# Altium schematic sheet Power.SchDoc
size A4
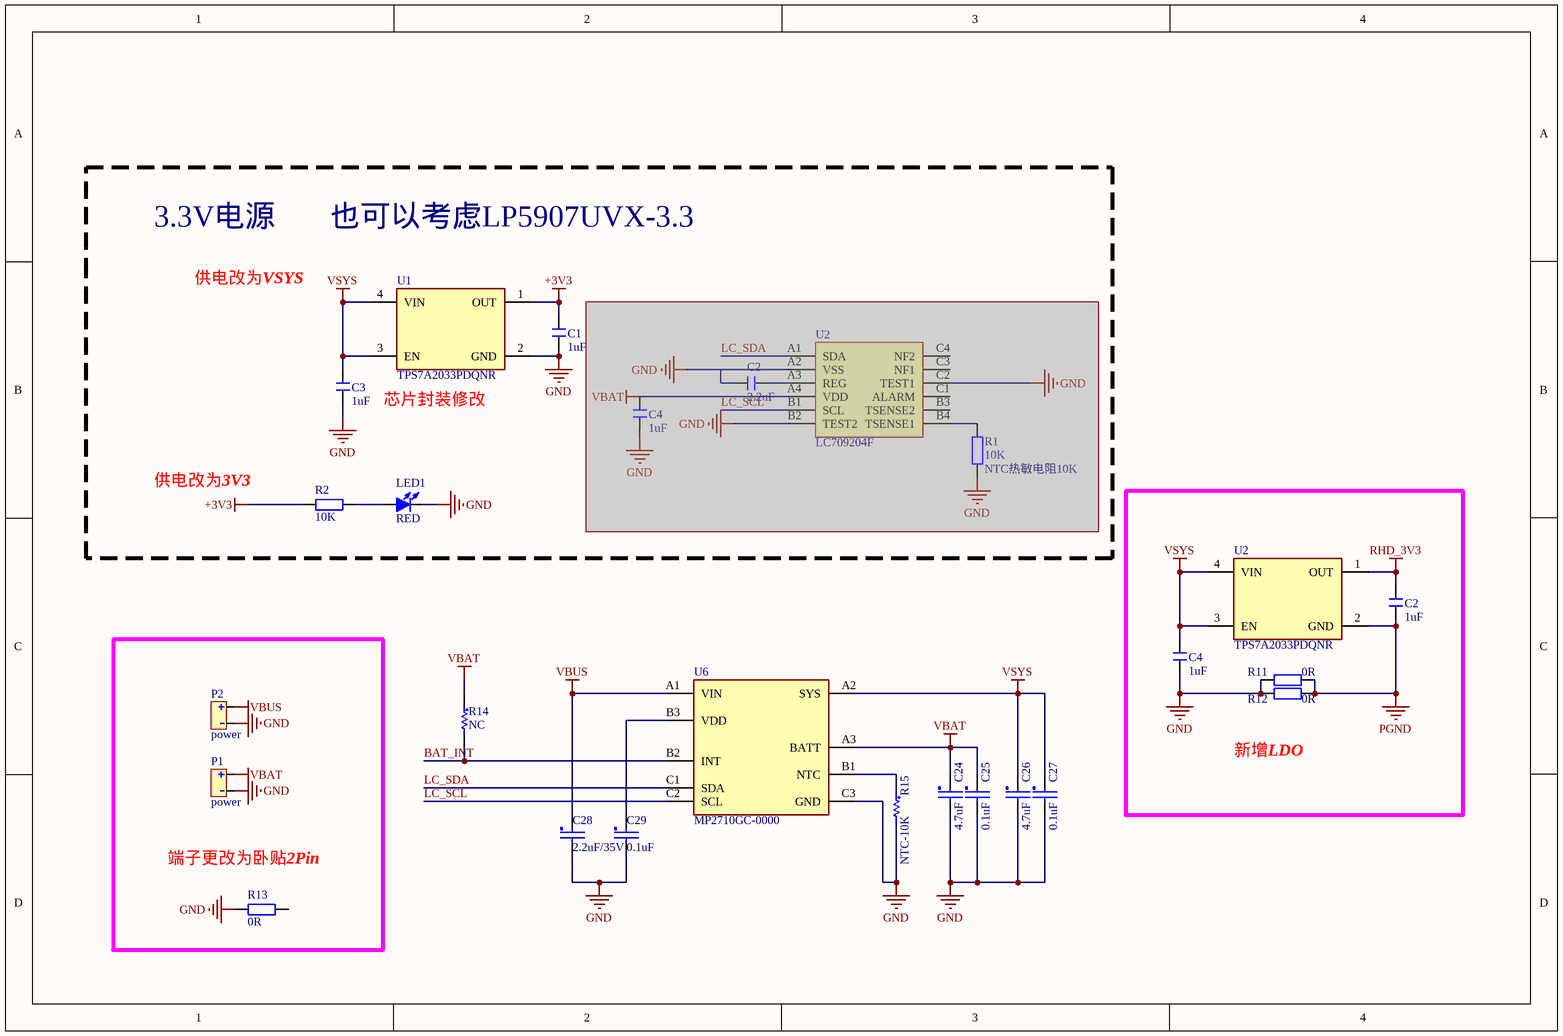
[diagram p0: Power.SchDoc]

## Parts
(Parts that share a designator on the sheet are numbered #1, #2 ... from top to bottom, then left to right.)
C1  1uF  [C 0201_L]
C2#1  2.2uF  [C 0201_L]  (masked out: inside a compile mask, not in the netlist)
C2#2  1uF  [C 0201_L]
C3  1uF  [C 0201_L]
C4#1  1uF  [C 0201_L]  (masked out: inside a compile mask, not in the netlist)
C4#2  1uF  [C 0201_L]
C24  4.7uF  [0201(C)]
C25  0.1uF  [0201(C)]
C26  4.7uF  [0201(C)]
C27  0.1uF  [0201(C)]
C28  2.2uF/35V  [0201(C)]
C29  0.1uF  [0201(C)]
LED1  RED  [LED-SMD_L0.7-W0.4-RD_BLUE - duplicate]
P1  power  [CONN-SMD_SM02B-SURS-TF-LF-SN - duplicate]
P2  power  [HDR-SMD_2P-P1.27-V-M-LS4.2-R1]
R1  10K  BOM名称: NTC热敏电阻10K  [R0201]  (masked out: inside a compile mask, not in the netlist)
R2  10K  [R 0201_L]
R11  0R  [R 0201_L]
R12  0R  [R 0201_L]
R13  0R  [0402(R)]
R14  NC  [0201(R)]  (no BOM)
R15  NTC-10K  [0201(R)]
U1  TPS7A2033PDQNR  [X2SON-0.4]
U2#1  LC709204F  [WLCSP-12_L2.0-W1.5-R3-C4-P0.40-TL]  (masked out: inside a compile mask, not in the netlist)
U2#2  TPS7A2033PDQNR  [X2SON-0.4]
U6  MP2710GC-0000  [WLCSP3*3-P0.5mm]

## Blocks framed on the sheet
新增LDO: C2#2 C4#2 R11 R12 U2#2
端子更改为卧贴2Pin: P1 P2 R13

## Nets
+3V3: C1.2 R2.1 U1.1(OUT)
GND: C1.1 C3.1 C4#2.1 C24.2 C25.2 C26.2 C27.2 C28.2 C29.2 LED1.2(K) P1.1(-) P2.1(-) R11.1 R12.1 R13.1 R15.2 U1.2(GND) U6.C3(GND)
PGND: C2#2.1 R11.2 R12.2 U2#2.2(GND)
RHD_3V3: C2#2.2 U2#2.1(OUT)
VBAT: C24.1 C25.1 P1.2(+) R14.1 U6.A3(BATT)
VBUS: C28.1 P2.2(+) U6.A1(VIN)
VSYS: C3.2 C4#2.2 C26.1 C27.1 U1.3(EN) U1.4(VIN) U2#2.3(EN) U2#2.4(VIN) U6.A2(SYS)
BAT_INT: R14.2 U6.B2(INT)
LC_SCL: U6.C2(SCL)
LC_SDA: U6.C1(SDA)
NetC29_1: C29.1 U6.B3(VDD)
NetLED1_1: LED1.1(A) R2.2
NetR15_1: R15.1 U6.B1(NTC)

Not connected (* = marked no-connect by the designer): R13 2

## Notes on the sheet
- 3.3V电源
- 也可以考虑LP5907UVX-3.3
- 供电改为VSYS
- 芯片封装修改
- 供电改为3V3

## Library data of the parts
C1 C2#1 C2#2 C3 C4#1 C4#2 = C: 贴片电容; BOM名称: 无极性贴片电容
  C1 C2#2 C3 C4#2: Value: 1uF
  C2#1: value: 2.2uF
  C4#1: value: 1uF
C24-C29 = CAP
LED1 = LED-SMD: 贴片LED; BOM名称: 贴片LED; Color: RED
R1 = R: NTC热敏电阻 10K; Value: 10K
R2 = R: 贴片电阻; BOM名称: 贴片电阻; Value: 10K
R11 R12 = R: 贴片电阻; Value: 10K; BOM名称: 贴片电阻
R13 = R: 贴片电阻 OR; Value: 10K; BOM名称: 贴片电阻
R14 R15 = Res Semi: Semiconductor Resistor; Value: 100; Published: 8-Jun-2000; LatestRevisionDate: 17-Jul-2002; LatestRevisionNote: Re-released for DXP Platform.; PackageReference: AXIAL-0.5; Publisher: Altium Limited; PackageDescription: Axial Device, Thru-Hole; 2 Leads; 0.5 in Pin Spacing
U1 U2#2 = IC_TPS7A2033PDQNR: TPS7A2033PDQNR/X2SON
U2#1 = LC709203F
U6 = MP2710